# Altium schematic sheet LedUnit.SchDoc
size A4
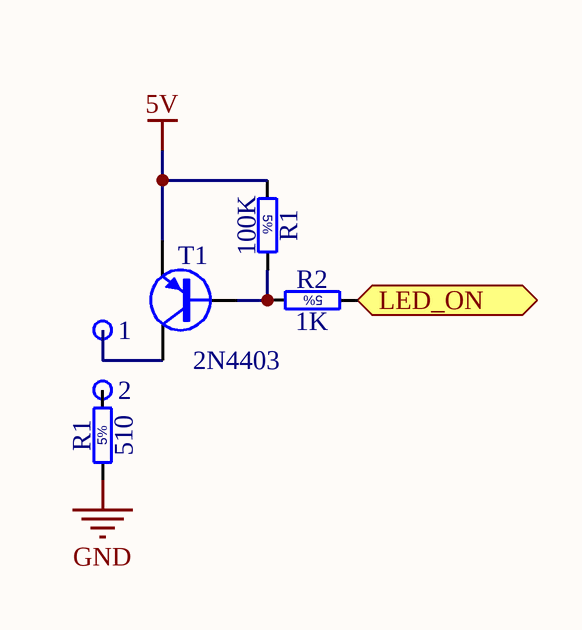
[diagram p0: LedUnit.SchDoc]

## Parts
(Parts that share a designator on the sheet are numbered #1, #2 ... from top to bottom, then left to right.)
1  Plated Hole  [c180h130]  (value not drawn)
2  Plated Hole  [c180h130]  (value not drawn)
R1#1  100K  [RES_ARCOL_RCC025]
R1#2  510  [RES_ARCOL_RCC025]
R2  1K  [RES_ARCOL_RCC025]
T1  2N4403  [TO-92AA-P254]

## Ports
LED_ON

## Nets
5V: R1#1.2 T1.1(E)
GND: R1#2.1
LED_ON: R2.1 ; port LED_ON
Net1_1: 1.1 T1.3(C)
Net2_1: 2.1 R1#2.2
NetR1#1_1: R1#1.1 R2.2 T1.2(B)

## Notes on the sheet
- (in symbol RCF_5K1_5%_0.25W_+10-6PPM_ARCOL_RCC025) 5%

## Library data of the parts
1 2 = PLATED_HOLE1.3_PAD1.8: Single Terminal Socket; Part Description: Plated Through Hole: Hole Dia.=1.3mm Pad Dia.=1.8mm; Mounted: No; Table: Pads; Part Number: PLATED_HOLE1.3_PAD1.8; Component Kind: Standard (No BOM); Component Type: Standard (No BOM); Pin Count: 1; Family: Plated Hole; Socket: No; SMD: No; Status: None; ComponentHeight: 0mm; Author: CERN DEM JLC; CreateDate: 30.10.2008; LatestRevisionDate: 30.10.2008; PackageDescription: Plated Through Hole: Hole Dia.=1.3mm Pad Dia.=1.8mm
R1#1 R1#2 R2 = RCF_5K1_5%_0.25W_+10-6PPM_ARCOL_RCC025: Resistor - 5%; Part Description: Solid Carbon Resistor RCC Series; Manufacturer: ARCOL; Manufacturer Part Number: RCC025 5k1 J; Power: 0.25W; TC: +10-6ppm/°C; Table: Resistors THD; Part Number: RCF_5K1_5%_0.25W_+10-6PPM_ARCOL_RCC025; Component Kind: Standard; Component Type: Standard; Pin Count: 2; Status: None; Tolerance: ±5%; Case: LS10.16 L6.3 x D2.4; Mounted: Yes; Socket: No; SMD: No; ComponentHeight: 2.5mm; HelpURL: \\cern.ch\dfs\Applications\Altium\Datasheets\RCF_ARCOL_RCC025.pdf; Author: CERN DEM JLC; CreateDate: 30.10.2013; LatestRevisionDate: 30.10.2013
  R1#1: Value: 100K
  R1#2: Value: 510
  R2: Value: 1K
T1 = 2N3906RL1G: PNP Transistor; Part Description: 40V 200mA PNP General Purpose Amplifier; Manufacturer: ON SEMICONDUCTOR; Table: Transistors; Part Number: 2N3906RL1G; Component Kind: Standard; Component Type: Standard; Device: 2N3906RL1G; PackageDescription: TO-92 (TO226), Pitch 2.54mm, Flat Index, 3 In-Line, Bent Leads, Body Dia. 5.3mm; Manufacturer Part Number: 2N3906RL1G; Pin Count: 3; Case: TO-92; Mounted: Yes; Socket: No; SMD: No; ComponentHeight: 7.7mm; HelpURL: \\cern.ch\dfs\Applications\Altium\Datasheets\2N3906RL1G.pdf; Author: CERN DEM JLC; CreateDate: 23.09.2009; LatestRevisionDate: 23.09.2009